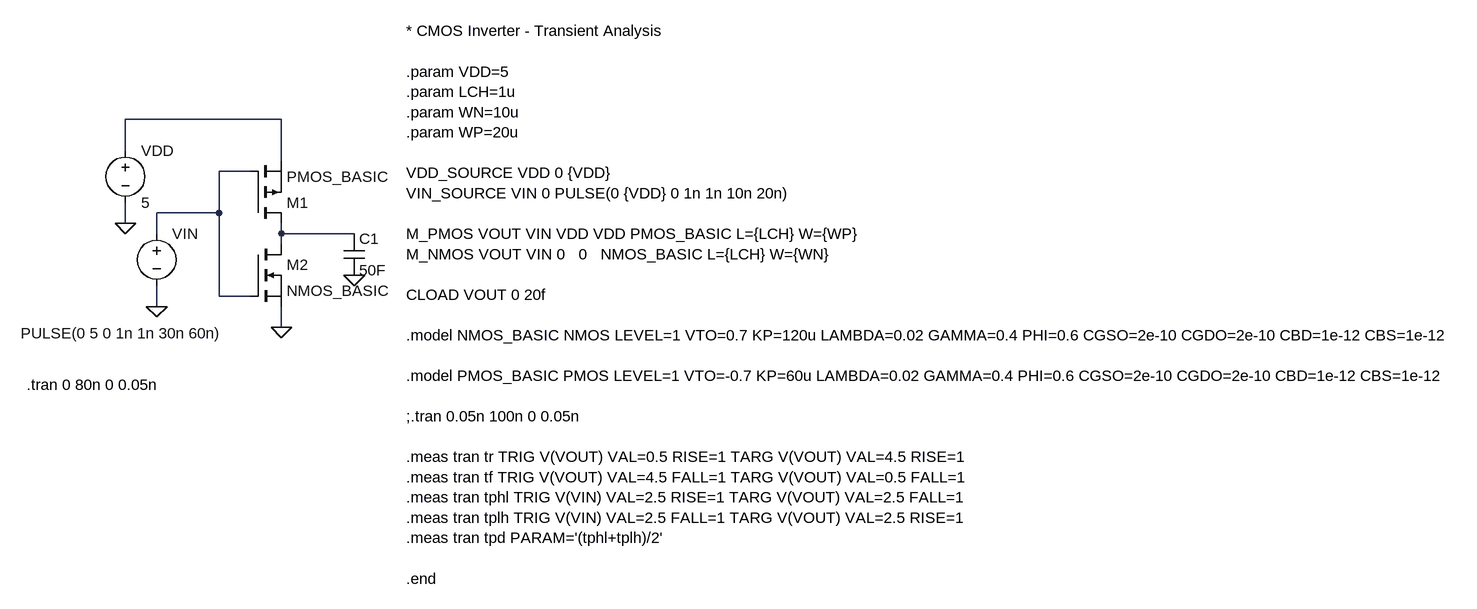
[diagram p0: schematic circuit.asc]
circuit.asc, the LTspice schematic file:
Version 4.1
SHEET 1 2040 680
WIRE 160 -16 -80 -16
WIRE -80 32 -80 -16
WIRE 160 48 160 -16
WIRE 112 64 64 64
WIRE 64 128 64 64
WIRE 64 128 -32 128
WIRE -80 144 -80 112
WIRE -32 160 -32 128
WIRE 160 160 160 144
WIRE 272 160 160 160
WIRE 160 176 160 160
WIRE 64 256 64 128
WIRE 112 256 64 256
WIRE -32 272 -32 240
WIRE 160 304 160 272
FLAG 160 304 0
FLAG -32 272 0
FLAG -80 144 0
FLAG 272 224 0
SYMBOL pmos 112 144 M180
SYMATTR InstName M1
SYMATTR Value PMOS_BASIC
SYMBOL nmos 112 176 R0
SYMATTR InstName M2
SYMATTR Value NMOS_BASIC
SYMBOL voltage -80 16 R0
WINDOW 123 0 0 Left 0
WINDOW 39 0 0 Left 0
SYMATTR InstName VDD
SYMATTR Value 5
SYMBOL voltage -32 144 R0
WINDOW 3 -209 169 Left 2
WINDOW 123 0 0 Left 0
WINDOW 39 0 0 Left 0
SYMATTR InstName VIN
SYMATTR Value PULSE(0 5 0 1n 1n 30n 60n)
SYMBOL cap 256 160 R0
SYMATTR InstName C1
SYMATTR Value 50F
TEXT -232 392 Left 2 !.tran 0 80n 0 0.05n
TEXT 352 -152 Left 2 !* CMOS Inverter - Transient Analysis\n \n.param VDD=5\n.param LCH=1u\n.param WN=10u\n.param WP=20u\n \nVDD_SOURCE VDD 0 {VDD}\nVIN_SOURCE VIN 0 PULSE(0 {VDD} 0 1n 1n 10n 20n)\n \nM_PMOS VOUT VIN VDD VDD PMOS_BASIC L={LCH} W={WP}\nM_NMOS VOUT VIN 0   0   NMOS_BASIC L={LCH} W={WN}\n \nCLOAD VOUT 0 20f\n \n.model NMOS_BASIC NMOS LEVEL=1 VTO=0.7 KP=120u LAMBDA=0.02 GAMMA=0.4 PHI=0.6 CGSO=2e-10 CGDO=2e-10 CBD=1e-12 CBS=1e-12\n \n.model PMOS_BASIC PMOS LEVEL=1 VTO=-0.7 KP=60u LAMBDA=0.02 GAMMA=0.4 PHI=0.6 CGSO=2e-10 CGDO=2e-10 CBD=1e-12 CBS=1e-12\n \n;.tran 0.05n 100n 0 0.05n\n \n.meas tran tr TRIG V(VOUT) VAL=0.5 RISE=1 TARG V(VOUT) VAL=4.5 RISE=1\n.meas tran tf TRIG V(VOUT) VAL=4.5 FALL=1 TARG V(VOUT) VAL=0.5 FALL=1\n.meas tran tphl TRIG V(VIN) VAL=2.5 RISE=1 TARG V(VOUT) VAL=2.5 FALL=1\n.meas tran tplh TRIG V(VIN) VAL=2.5 FALL=1 TARG V(VOUT) VAL=2.5 RISE=1\n.meas tran tpd PARAM='(tphl+tplh)/2'\n \n.end

The netlist it stands for:
* circuit.asc
M1 N003 N002 N001 N001 PMOS_BASIC
M2 N003 N002 0 0 NMOS_BASIC
VDD N001 0 5
VIN N002 0 PULSE(0 5 0 1n 1n 30n 60n)
C1 N003 0 50F
.model NMOS NMOS
.model PMOS PMOS
.lib standard.mos
.tran 0 80n 0 0.05n
* CMOS Inverter - Transient Analysis
.param VDD=5
.param LCH=1u
.param WN=10u
.param WP=20u
VDD_SOURCE VDD 0 {VDD}
VIN_SOURCE VIN 0 PULSE(0 {VDD} 0 1n 1n 10n 20n)
M_PMOS VOUT VIN VDD VDD PMOS_BASIC L={LCH} W={WP}
M_NMOS VOUT VIN 0   0   NMOS_BASIC L={LCH} W={WN}
CLOAD VOUT 0 20f
.model NMOS_BASIC NMOS LEVEL=1 VTO=0.7 KP=120u LAMBDA=0.02 GAMMA=0.4 PHI=0.6 CGSO=2e-10 CGDO=2e-10 CBD=1e-12 CBS=1e-12
.model PMOS_BASIC PMOS LEVEL=1 VTO=-0.7 KP=60u LAMBDA=0.02 GAMMA=0.4 PHI=0.6 CGSO=2e-10 CGDO=2e-10 CBD=1e-12 CBS=1e-12
;.tran 0.05n 100n 0 0.05n
.meas tran tr TRIG V(VOUT) VAL=0.5 RISE=1 TARG V(VOUT) VAL=4.5 RISE=1
.meas tran tf TRIG V(VOUT) VAL=4.5 FALL=1 TARG V(VOUT) VAL=0.5 FALL=1
.meas tran tphl TRIG V(VIN) VAL=2.5 RISE=1 TARG V(VOUT) VAL=2.5 FALL=1
.meas tran tplh TRIG V(VIN) VAL=2.5 FALL=1 TARG V(VOUT) VAL=2.5 RISE=1
.meas tran tpd PARAM='(tphl+tplh)/2'
.end
.backanno
.end